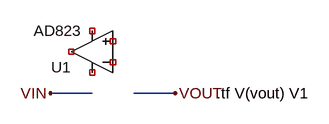
[diagram p0: schematic case_07.asc]
case_07.asc, the LTspice schematic file:
Version 4.1
SHEET 1 880 680
WIRE 480 320 416 320
WIRE 544 320 608 320
FLAG 416 320 VIN
FLAG 608 320 VOUT
SYMBOL OpAmps\AD823 480 320 R180
WINDOW 0 32 40 Left 2
SYMATTR InstName U1
SYMATTR Value AD823
SYMATTR SpiceLine GBW=16Meg
SYMATTR Type opamp
TEXT 672 320 Left 2 !.tf V(vout) V1

The netlist it stands for:
* case_07.asc
X§U1 NC_01 NC_02 NC_03 NC_04 NC_05 AD823 GBW=16Meg  ; pins In+ In- V+ V- OUT
.tf V(vout) V1
.lib ADI.lib
.backanno
.end